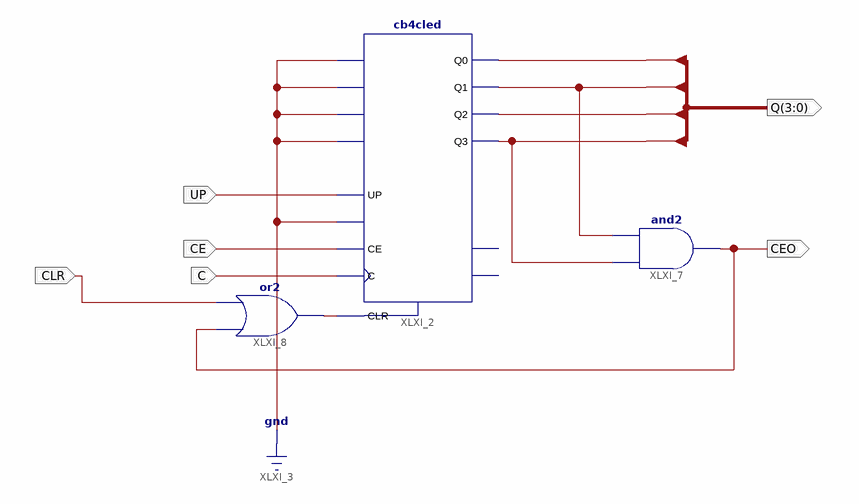
[diagram p0: schematic sheet 1]
// Xilinx ISE schematic CB4CEDBCD.sch (spartan3e) as structural Verilog: 3 symbols, 6 ports
module CB4CEDBCD (
  input  UP,
  input  CE,
  input  C,
  input  CLR,
  output CEO,
  output [3:0] Q
);

  wire XLXN_48;

  cb4cled XLXI_2 (
    .C(C), .CE(CE), .CLR(XLXN_48), .D0(1'b0), .D1(1'b0), .D2(1'b0), .D3(1'b0), .L(1'b0), .UP(UP), .Q0(Q[0]),
    .Q1(Q[1]), .Q2(Q[2]), .Q3(Q[3]));  // open: CEO, TC
  and XLXI_7 (CEO, Q[3], Q[1]);
  or XLXI_8 (XLXN_48, CEO, CLR);
endmodule
